# EAGLE schematic onboard_3 (EAGLE 7.5.0)
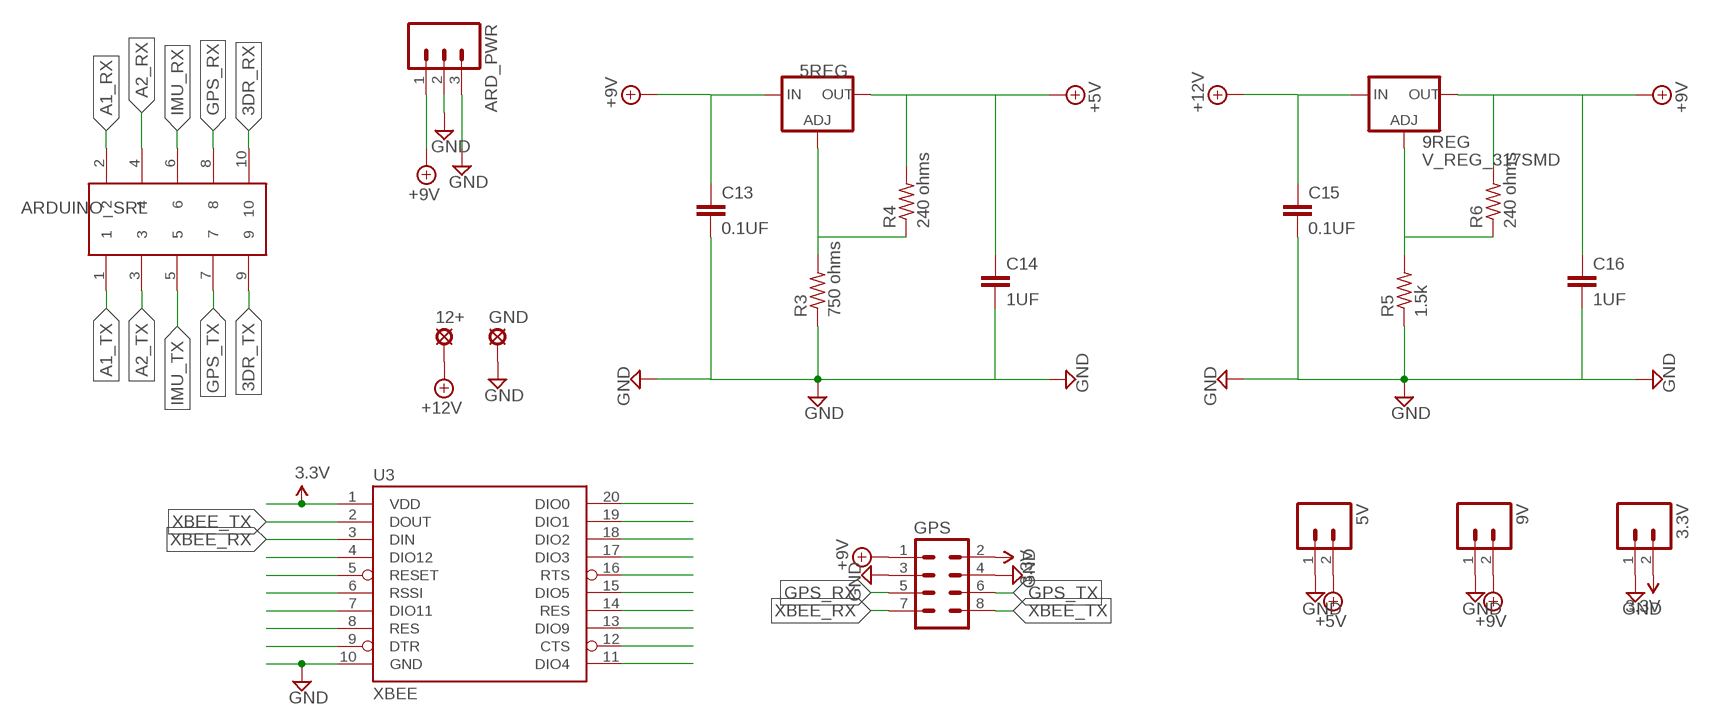
[diagram p0: schematic, sheet 1, part 1 of 2]
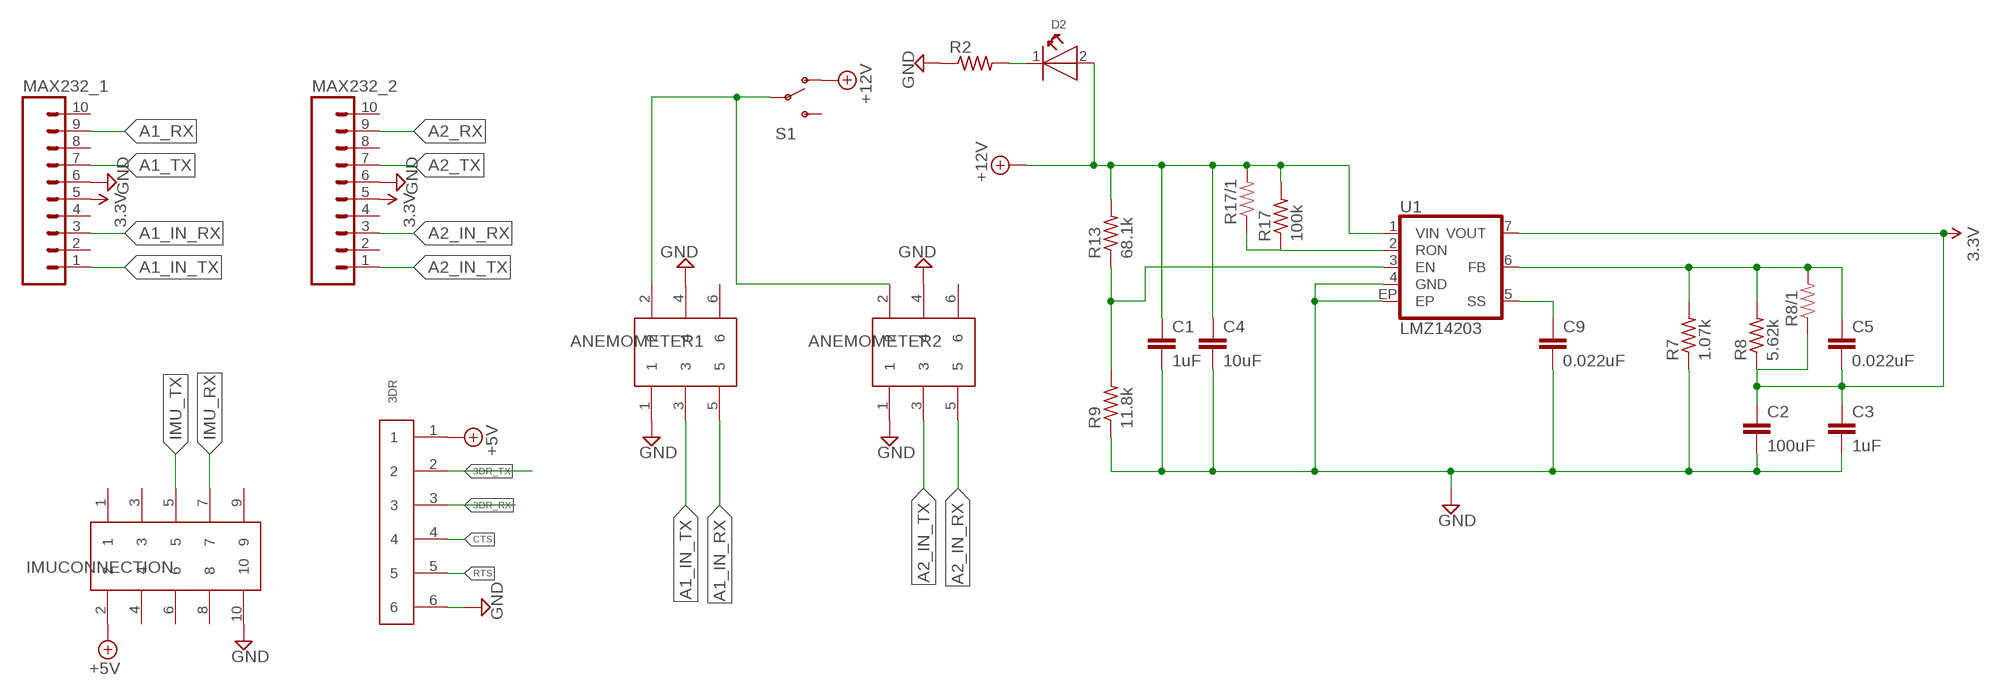
[diagram p1: schematic, sheet 1, part 2 of 2]

## Parts
3.3V  M02  [02P]
3DR  653006114822  [653006114822]
5REG  V_REG_317SMD  [SOT223]
5V  M02  [02P]
9REG  V_REG_317SMD  [SOT223]
9V  M02  [02P]
12+  SE14  [SE14]
ANEMOMETER1  61200622323  [61200622323]
ANEMOMETER2  61200622323  [61200622323]
ARD_PWR  M03  [03P]
ARDUINO_SRL  61201022323  [61201022323]
C1  1uF  1UF-25V-10%(0805)  [0805]
C2  100uF  CAP1206  [1206]
C3  1uF  1UF-25V-10%(0805)  [0805]
C4  10uF  CAP0805  [0805]
C5  0.022uF  CAP0603-CAP  [0603-CAP]
C9  0.022uF  CAP0603-CAP  [0603-CAP]
C13  0.1UF  1UF-25V-10%(0805)  [0805]
C14  1UF  1UF-25V-10%(0805)  [0805]
C15  0.1UF  1UF-25V-10%(0805)  [0805]
C16  1UF  1UF-25V-10%(0805)  [0805]
D2  WL-SMCW-150120BS75000-B  [1206]
GND  SE14  [SE14]
GPS  M04X2  [2X4]
IMUCONNECTION  62501021621  [62501021621]
MAX232_1  M10  [10P]
MAX232_2  M10  [10P]
R2  R-US_M2012  [M2012]
R3  750 ohms  R-US_M2012  [M2012]
R4  240 ohms  R-US_M2012  [M2012]
R5  1.5k  R-US_M2012  [M2012]
R6  240 ohms  R-US_M2012  [M2012]
R7  1.07k  R-US_M2012  [M2012]
R8  5.62k  R-US_M2012  [M2012]
R8/1  RESISTORPTH-1/2W  [AXIAL-0.5]
R9  11.8k  R-US_M2012  [M2012]
R13  68.1k  R-US_M2012  [M2012]
R17  100k  R-US_M2012  [M2012]
R17/1  RESISTORPTH-1/2W  [AXIAL-0.5]
S1  SWITCH-SPDTSMD2  [SWITCH-SPDT-SMD]
U1  LMZ14203  [TO-PMOD-7]
U3  XBEE  XBEE-1B1  [XBEE-1]

## Nets
3.3V: 3.3V.2 C2.1 C3.1 C5.2 GPS.2 MAX232_1.5 MAX232_2.5 R8.1 R8/1.P$1 U1.7(VOUT) U3.1(VDD)
3DR_RX: 3DR.3 ARDUINO_SRL.10
3DR_TX: 3DR.2 ARDUINO_SRL.9
+5V: 3DR.1 5REG.2(OUT) 5V.2 C14.1 IMUCONNECTION.2 R4.2
+9V: 5REG.3(IN) 9REG.2(OUT) 9V.2 ARD_PWR.1 C13.1 C16.1 GPS.1 R6.2
+12V: 9REG.3(IN) 12+.MP C1.1 C4.1 C15.1 D2.2(A) R13.2 R17.2 R17/1.P$2 S1.1(O) U1.1(VIN)
A1_IN_RX: ANEMOMETER1.5 MAX232_1.3
A1_IN_TX: ANEMOMETER1.3 MAX232_1.1
A1_RX: ARDUINO_SRL.2 MAX232_1.9
A1_TX: ARDUINO_SRL.1 MAX232_1.7
A2_IN_RX: ANEMOMETER2.5 MAX232_2.3
A2_IN_TX: ANEMOMETER2.3 MAX232_2.1
A2_RX: ARDUINO_SRL.4 MAX232_2.9
A2_TX: ARDUINO_SRL.3 MAX232_2.7
CTS: 3DR.4
GND: 3.3V.1 3DR.6 5V.1 9V.1 ANEMOMETER1.1 ANEMOMETER1.4 ANEMOMETER2.1 ANEMOMETER2.4 ARD_PWR.2 ARD_PWR.3 C1.2 C2.2 C3.2 C4.2 C9.2 C13.2 C14.2 C15.2 C16.2 GND.MP GPS.3 GPS.4 IMUCONNECTION.10 MAX232_1.6 MAX232_2.6 R2.1 R3.1 R5.1 R7.1 R9.1 U1.4(GND) U1.EP U3.10(GND)
GPS_RX: ARDUINO_SRL.8 GPS.5
GPS_TX: ARDUINO_SRL.7 GPS.6
IMU_RX: ARDUINO_SRL.6 IMUCONNECTION.7
IMU_TX: ARDUINO_SRL.5 IMUCONNECTION.5
N$1: U3.5(RESET)
N$2: 5REG.1(ADJ) R3.2 R4.1
N$3: 9REG.1(ADJ) R5.2 R6.1
N$4: R9.2 R13.1 U1.3(EN)
N$5: R17.1 R17/1.P$1 U1.2(RON)
N$6: C9.1 U1.5(SS)
N$7: D2.1(K) R2.2
N$8: C5.1 R7.2 R8.2 R8/1.P$2 U1.6(FB)
N$9: ANEMOMETER1.2 ANEMOMETER2.2 S1.2(P)
N$24: U3.4(DIO12)
N$26: U3.6(RSSI)
N$27: U3.7(DIO11)
N$28: U3.8(RES)
N$29: U3.9(DTR)
N$31: U3.11(DIO4)
N$32: U3.12(CTS)
N$33: U3.13(DIO9)
N$34: U3.14(RES)
N$35: U3.15(DIO5)
N$36: U3.16(RTS)
N$37: U3.17(DIO3)
N$38: U3.18(DIO2)
N$39: U3.19(DIO1)
N$40: U3.20(DIO0)
RTS: 3DR.5
XBEE_RX: GPS.7 U3.3(DIN)
XBEE_TX: GPS.8 U3.2(DOUT)
Unconnected: ANEMOMETER1.6 ANEMOMETER2.6 IMUCONNECTION.1 IMUCONNECTION.3 IMUCONNECTION.4 IMUCONNECTION.6 IMUCONNECTION.8 IMUCONNECTION.9 MAX232_1.2 MAX232_1.4 MAX232_1.8 MAX232_1.10 MAX232_2.2 MAX232_2.4 MAX232_2.8 MAX232_2.10 S1.3(S)

## Library data of the parts
3.3V 5V 9V = con-amp-quick:M02: AMP QUICK CONNECTOR; OC_FARNELL: unknown; OC_NEWARK: unknown
3DR = Wire_to_Board_Connectors_rev15d:653006114822: WR-WTB 1.25mm Male Vertical Shrouded Header,6 Pins=>Code : Con_WTB_1.25_PCB_THT_653006114822 <http://katalog.we-online.de/media/thumbs2/eican/thb_Con_WTB_1.25_PCB_THT_6530xx114822_pf2.jpg> Details see: http://katalog.we-online.de/en/em/653_0xx_114_822 Created 2014-06-06, Karrer Zheng 2014 (C) Würth Elektronik; OC_NEWARK: unknown
5REG 9REG = SparkFun-PowerIC:V_REG_317: Voltage Regulator Standard LM317 adjustable voltage regulator. AOI (Adjust Output Input). Google 'LM317 Calculator' for easy to use app to get the two resistor values needed. 240/720 for 5V output. 240/390 for 3.3V output. Spark Fun Electronics SKU : COM-00527; OC_NEWARK: unknown
12+ GND = solpad:SE14: SOLDER PAD E1553, drill 1,4mm, distributor Buerklin, 07F820; OC_NEWARK: unknown
ANEMOMETER1 ANEMOMETER2 = Wurth_Elektronik_Electromechanic_Wire_to_Board_Connectors_rev15c:61200622323: WR-BHD 2.54mm Board to Cable Transition Connector, 6 Pins=>Code : Con_WTB_IDC_61200622323 <http://katalog.we-online.de/media/thumbs2/eican/thb_Con_WTB_IDC_6120xx22323_pf2.jpg> Details see: http://katalog.we-online.de/en/em/612_0xx_223_23 Created 2014-06-05, Karrer Zheng 2014 (C) Würth Elektronik; OC_NEWARK: unknown
ARD_PWR = con-amp-quick:M03: AMP QUICK CONNECTOR; OC_FARNELL: unknown; OC_NEWARK: unknown
ARDUINO_SRL = Wire_to_Board_Connectors_rev15d:61201022323: WR-BHD 2.54mm Board to Cable Transition Connector, 10 Pins=>Code : Con_WTB_IDC_61201022323 <http://katalog.we-online.de/media/thumbs2/eican/thb_Con_WTB_IDC_6120xx22323_pf2.jpg> Details see: http://katalog.we-online.de/en/em/612_0xx_223_23 Created 2014-06-05, Karrer Zheng 2014 (C) Würth Elektronik; OC_NEWARK: unknown
C1 C3 = SparkFun-Capacitors:1UF-25V-10%(0805): CAP-08064; MF: VISHAY/SPRAGUE; MPN: 1C10Z5U104M050R; OC_NEWARK: 66C6034; PROD_ID: CAP-08064
C2 C4 C5 C9 = SparkFun-Capacitors:CAP: Capacitor Standard 0603 ceramic capacitor, and 0.1" leaded capacitor.; OC_NEWARK: unknown
C13-C16 = SparkFun-Capacitors:1UF-25V-10%(0805): CAP-08064; OC_NEWARK: unknown; PROD_ID: CAP-08064; VALUE: 1uF
D2 = Wuerth_Elektronik_LEDs_rev15b:WL-SMCW: SMD mono-color Chip LED Characteristics Low energy consumption High reliability Low current requirement Fast switching No UV/IR radiation Smallest SMD package with exceptional brightness Top view Wide viewing angle PBC high-usage Applications Backlight for mobile and portable device keypads Indoor and outdoor message boards Flat backlight for LCDs, switches and symbols Display for industrial control systems and traffic Miniaturized color effects Pedestrian mark Optical indicators General lighting Toys <http://katalog.we-online.de/media/images/eipal/WL-SMCW_pf2.jpg> Details see: http://katalog.we-online.de/en/led/WL-SMCW?m Updated 2015-04-10 2015 (C) Wurth Elektronik; COMPANY-URL: http://www.we-online.de; CREATED-BY: Christin Otto; CREATED-DATE: APR 2013; DATASHEET-URL: http://katalog.we-online.de/en/led/WL-SMCW?m=t&sq=smcw&sp=&sp=http%3A%2F%2Fwww.we-online.de%2Fweb%2Fen%2Felectronic_components%2Fsearchpage_PBS.php%3Fsearch%3Dsmcw#vs_t2:2; MANUFACTURER: Würth Elektronik eiSos GmbH; OC_NEWARK: unknown
GPS = SparkFun-Connectors:M04X2: .1" header, two rows of four.; OC_NEWARK: unknown
IMUCONNECTION = Wurth_Elektronik_Electromechanic_Wire_to_Board_Connectors_rev15c:62501021621: WR-BHD 2.00mm Male Box Header, 10 Pins=>Code : Con_WTB_BHD_2.00_Male_THT_62501021621 <http://katalog.we-online.de/media/thumbs2/eican/thb_Con_WTB_BHD_2.00_Male_THT_6250xx21621_pf2.jpg> Details see: http://katalog.we-online.de/en/em/625_0xx_216_21 Created 2014-06-05, Karrer Zheng 2014 (C) Würth Elektronik; OC_NEWARK: unknown
MAX232_1 MAX232_2 = con-amp-quick:M10: AMP QUICK CONNECTOR; OC_FARNELL: unknown; OC_NEWARK: unknown
R2 R7-R9 R13 R17 = resistor:R-US_: RESISTOR, American symbol; OC_NEWARK: unknown
R3-R6 = adafruit:R-US_: RESISTOR, American symbol; OC_NEWARK: unknown
R8/1 R17/1 = SparkFun-Passives:RESISTOR: Resistor Basic schematic elements and footprints for 0603, 1206, and PTH resistors.; OC_NEWARK: unknown
S1 = SparkFun-Electromechanical:SWITCH-SPDT: SPDT Switch Simple slide switch, Spark Fun Electronics SKU : COM-00102 DPDT SMT slide switch, AYZ0202, SWCH-08179; OC_NEWARK: unknown
U1 = SparkFun-PowerIC:LMZ14203: 3A, Simple Switcher Power Module with 42V Maximum Input; OC_NEWARK: unknown
U3 = SparkFun:XBEE-1; OC_NEWARK: unknown

## Net classes
0 default: width 0.406 mm, drill 0.406 mm, clearance 0.432 mm